# Altium schematic sheet Relay connected.SchDoc
size A2
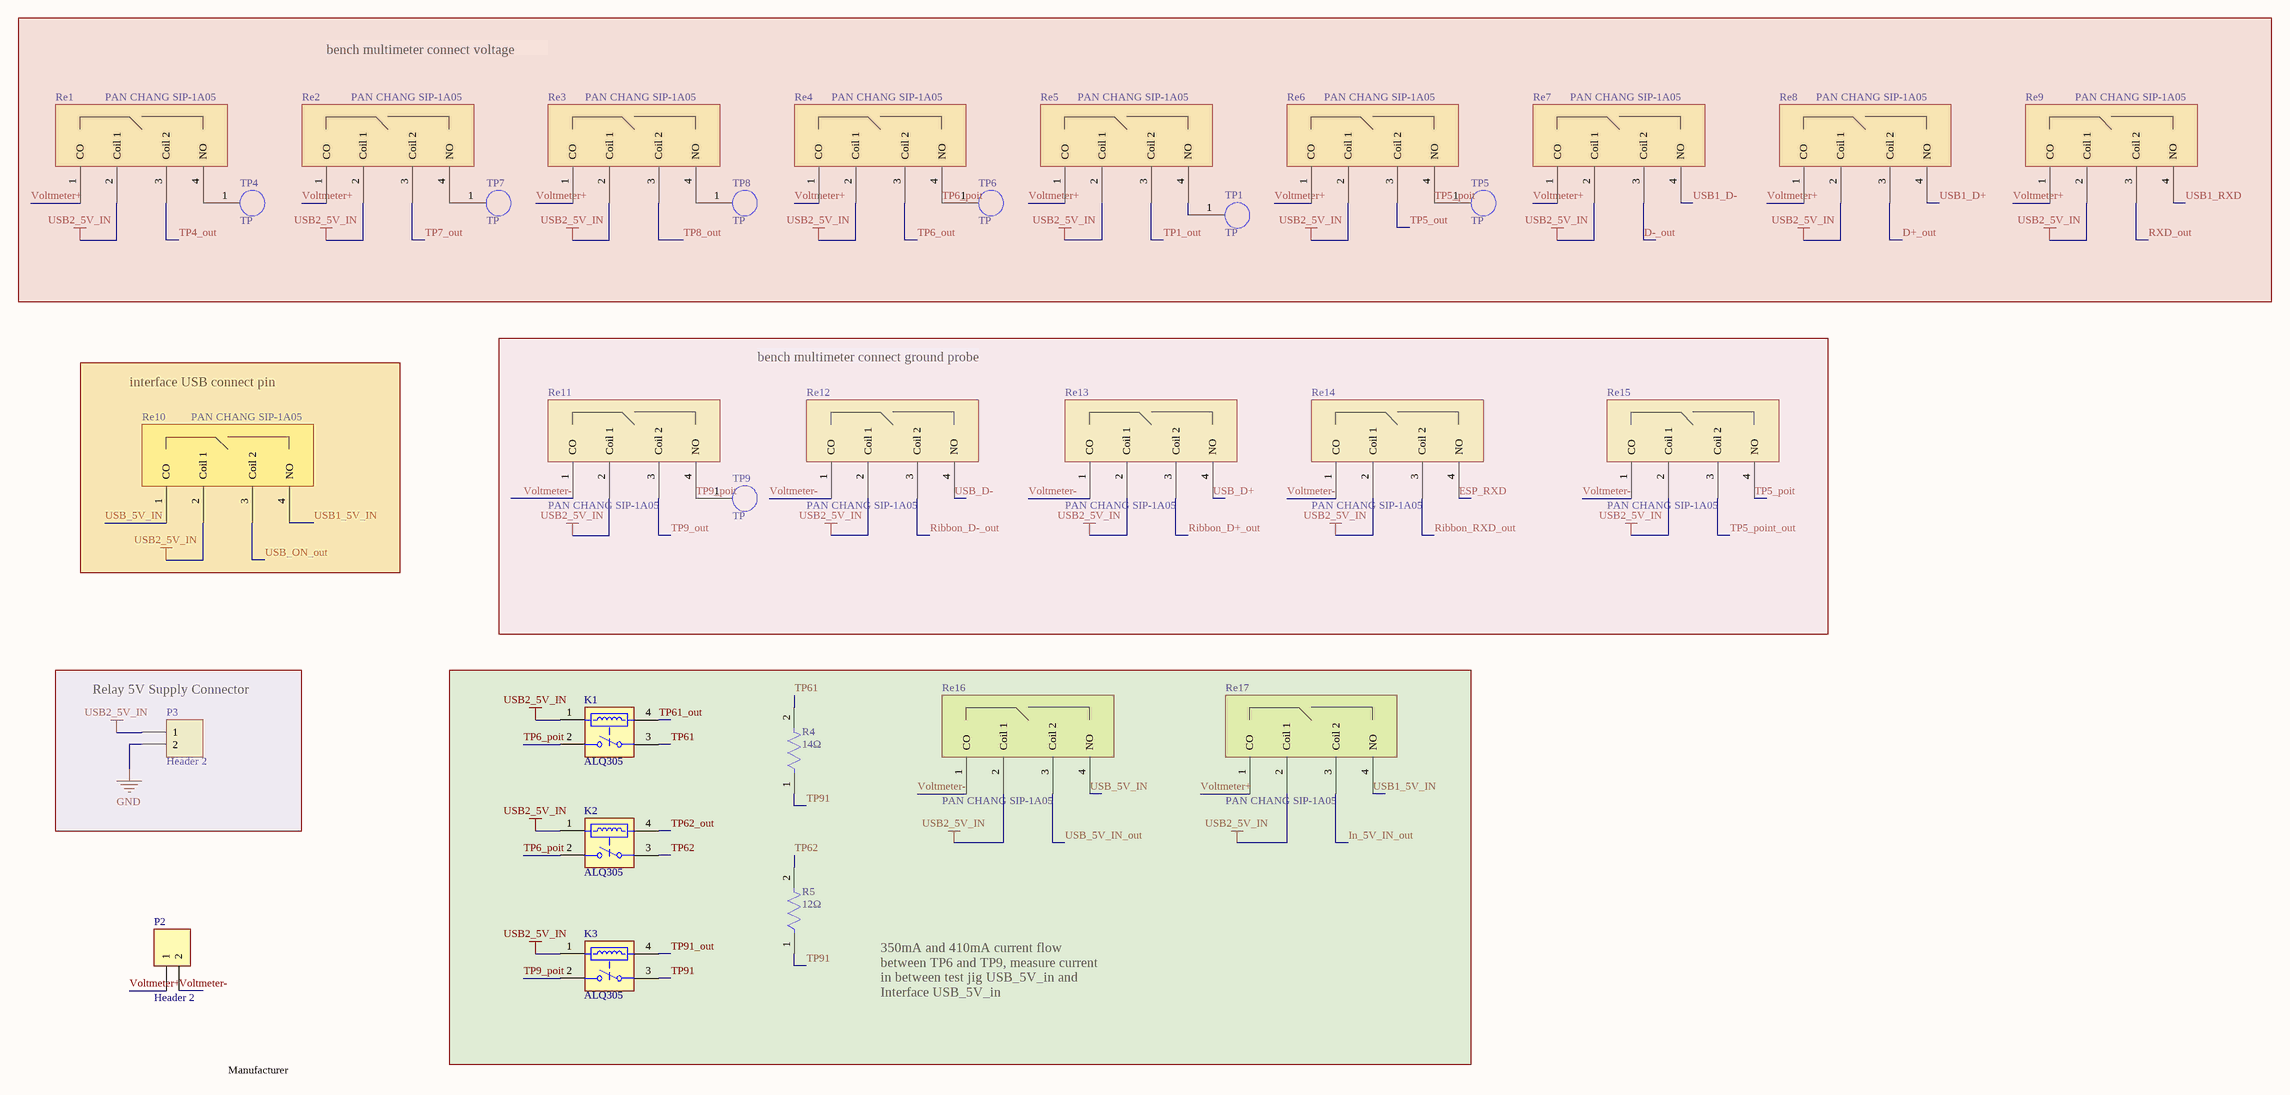
[diagram p0: Relay connected.SchDoc]

## Parts
K1  ALQ305  [PNSC-LQ-4-2000x1000x1600_V]
K2  ALQ305  [PNSC-LQ-4-2000x1000x1600_V]
K3  ALQ305  [PNSC-LQ-4-2000x1000x1600_V]
P2  Header 2  [HDR1X2]
P3  Header 2  [HDR1X2]
R4  14Ω  [FP-CRCW0603-e3-IPC_B]
R5  12Ω  [FP-CRCW0805-e3-IPC_C]
Re1  PAN CHANG SIP-1A05  [PAN CHANG SIP-1A05]
Re2  PAN CHANG SIP-1A05  [PAN CHANG SIP-1A05]
Re3  PAN CHANG SIP-1A05  [PAN CHANG SIP-1A05]
Re4  PAN CHANG SIP-1A05  [PAN CHANG SIP-1A05]
Re5  PAN CHANG SIP-1A05  [PAN CHANG SIP-1A05]
Re6  PAN CHANG SIP-1A05  [PAN CHANG SIP-1A05]
Re7  PAN CHANG SIP-1A05  [PAN CHANG SIP-1A05]
Re8  PAN CHANG SIP-1A05  [PAN CHANG SIP-1A05]
Re9  PAN CHANG SIP-1A05  [PAN CHANG SIP-1A05]
Re10  PAN CHANG SIP-1A05  [PAN CHANG SIP-1A05]
Re11  PAN CHANG SIP-1A05  [PAN CHANG SIP-1A05]
Re12  PAN CHANG SIP-1A05  [PAN CHANG SIP-1A05]
Re13  PAN CHANG SIP-1A05  [PAN CHANG SIP-1A05]
Re14  PAN CHANG SIP-1A05  [PAN CHANG SIP-1A05]
Re15  PAN CHANG SIP-1A05  [PAN CHANG SIP-1A05]
Re16  PAN CHANG SIP-1A05  [PAN CHANG SIP-1A05]
Re17  PAN CHANG SIP-1A05  [PAN CHANG SIP-1A05]
TP1  TP  [Testpoint]  (net tie, no BOM)
TP4  TP  [Testpoint]  (net tie, no BOM)
TP5  TP  [Testpoint]  (net tie, no BOM)
TP6  TP  [Testpoint]  (net tie, no BOM)
TP7  TP  [Testpoint]  (net tie, no BOM)
TP8  TP  [Testpoint]  (net tie, no BOM)
TP9  TP  [Testpoint]  (net tie, no BOM)

## Nets
GND: P3.2
USB2_5V_IN: K1.1 K2.1 K3.1 P3.1 Re1.2(Coil_1) Re2.2(Coil_1) Re3.2(Coil_1) Re4.2(Coil_1) Re5.2(Coil_1) Re6.2(Coil_1) Re7.2(Coil_1) Re8.2(Coil_1) Re9.2(Coil_1) Re10.2(Coil_1) Re11.2(Coil_1) Re12.2(Coil_1) Re13.2(Coil_1) Re14.2(Coil_1) Re15.2(Coil_1) Re16.2(Coil_1) Re17.2(Coil_1)
D+_out: Re8.3(Coil_2)
D-_out: Re7.3(Coil_2)
ESP_RXD: Re14.4(NO)
In_5V_IN_out: Re17.3(Coil_2)
Ribbon_D+_out: Re13.3(Coil_2)
Ribbon_D-_out: Re12.3(Coil_2)
Ribbon_RXD_out: Re14.3(Coil_2)
RXD_out: Re9.3(Coil_2)
TP1_out: Re5.3(Coil_2)
TP4_out: Re1.3(Coil_2)
TP5_out: Re6.3(Coil_2)
TP5_point_out: Re15.3(Coil_2)
TP5_poit: Re6.4(NO) Re15.4(NO) TP5.1
TP6_out: Re4.3(Coil_2)
TP6_poit: K1.2(NO) K2.2(NO) Re4.4(NO) TP6.1
TP7_out: Re2.3(Coil_2)
TP8_out: Re3.3(Coil_2)
TP9_out: Re11.3(Coil_2)
TP9_poit: K3.2(NO) Re11.4(NO) TP9.1
TP61: K1.3(COM) R4.2
TP61_out: K1.4
TP62: K2.3(COM) R5.2
TP62_out: K2.4
TP91: K3.3(COM) R4.1 R5.1
TP91_out: K3.4
USB1_5V_IN: Re10.4(NO) Re17.4(NO)
USB1_D+: Re8.4(NO)
USB1_D-: Re7.4(NO)
USB1_RXD: Re9.4(NO)
USB_5V_IN: Re10.1(CO) Re16.4(NO)
USB_5V_IN_out: Re16.3(Coil_2)
USB_D+: Re13.4(NO)
USB_D-: Re12.4(NO)
USB_ON_out: Re10.3(Coil_2)
Voltmeter+: P2.1 Re1.1(CO) Re2.1(CO) Re3.1(CO) Re4.1(CO) Re5.1(CO) Re6.1(CO) Re7.1(CO) Re8.1(CO) Re9.1(CO) Re17.1(CO)
Voltmeter-: P2.2 Re11.1(CO) Re12.1(CO) Re13.1(CO) Re14.1(CO) Re15.1(CO) Re16.1(CO)
NetRe1_4: Re1.4(NO) TP4.1
NetRe2_4: Re2.4(NO) TP7.1
NetRe3_4: Re3.4(NO) TP8.1
NetRe5_4: Re5.4(NO) TP1.1

## Notes on the sheet
- bench multimeter connect voltage probe
- interface USB connect pin
- bench multimeter connect ground probe
- (near P3) Relay 5V Supply Connector
- 350mA and 410mA current flow between TP6 and TP9, measure current in between test jig USB_5V_in and Interface USB_5V_in
- Manufacturer
- Title
- Size:
- Date:
- File:
- A2
- Number:
- Time:
- Revision:
- Sheet
- of

## Library data of the parts
K1-K3 = CMP-1503-00188-1: LQ Relays, 5 V Coil Voltage, 200 mW Nominal Operating Power, -40 to 85 degC, 4-Pin LQ, Carton, Case, RoHS; Manufacturer: Panasonic; Pb-Free: True; Nominal Operating Power: 200 mW; Max Switching Voltage: 250 V AC; Coil Voltage: 5 V; Max Switching Current: 10 A (N.O.), 3 A (N.C.); Mechanical Life(Min.operation): 1x10^7; Electrical Life: 5x10^4; ComponentLink2URL: http://www3.panasonic.biz/ac/e_download/control/relay/power/catalog/mech_eng_lq.pdf?f_cd=401220; ComponentLink3Description: Package Specification; Mfr. Part #: ALQ305; PackageDescription: 4-Pin Through Hole Terminal Package, Body 20 x 10 mm; Packing: Carton, Case; ComponentLink2Description: Datasheet; ComponentLink1URL: http://www3.panasonic.biz/ac/ae/index.jsp; PackageReference: LQ-4-2000x1000x1600; DatasheetVersion: 201410-T; Mounting Technology: Through Hole; RoHS: True; ComponentLink3URL: http://www3.panasonic.biz/ac/e_download/control/relay/power/catalog/mech_eng_lq.pdf?f_cd=401220; ComponentLink1Description: Manufacturer URL; PackageVersion: ASCTB92E, 10/2014; Series: LQ Relays
P2 P3 = Header 2: Header, 2-Pin; LatestRevisionDate: 17-Jul-2002; LatestRevisionNote: Re-released for DXP Platform.; Publisher: Altium Limited
R4 = CMP-02407-002335-1: RES Thick Film, 14Ω, 1%, 0.1W, 100ppm/°C, 0603; Manufacturer: SEI(Stackpole Elec); Mfr. Part #: RC0603FR-0714RL; Max Power Dissipation: 100mW; Voltage Rating (DC): 75V; Resistance: 14R; Contact Plating: Tin; Radiation Hardening: No; Features: Automotive AEC-Q200; Case Code (Imperial): 0603; Case Code (Metric): 1608; Case/Package: 0603; Lead Free: Lead Free; Max Operating Temperature: 155°C; Package Quantity: 10; Depth: 0.85mm; Weight: 7.1E-05oz; Temperature Coefficient: 100ppm/°C; Width: 0.033inch; Military Standard: Not; Composition: Thick Film; Min Operating Temperature: -55°C; Number of Pins: 2; Voltage Rating: 75V; Length: 1.55mm; Power Rating: 100mW; Number of Terminations: 2; Packaging: Tape and Reel; Height: 0.02inch; Tolerance: 1%
R5 = CMP-1013-00292-2: RES Thick Film, 12Ω, 1%, 0.125W, 100ppm/°C, 0805; Manufacturer: Vishay; Mfr. Part #: CRCW080512R0FKEA; Resistance: 12R; Voltage Rating: 150V; Max Power Dissipation: 125mW; Max Operating Temperature: 155°C; Composition: Thick Film; Case/Package: 0805; Length: 2mm; Features: Automotive AEC-Q200; Termination: SMD/SMT; Width: 0.049inch; Weight: 0.000194oz; Military Standard: Not; Lead Free: Lead Free; Temperature Coefficient: 100ppm/°C; Power Rating: 125mW; Case Code (Imperial): 0805; Number of Terminations: 2; Voltage Rating (DC): 150V; Height: 0.02inch; Depth: 1.25mm; Case Code (Metric): 2012; Packaging: Tape and Reel; Tolerance: 1%; Package Quantity: 10; Min Operating Temperature: -55°C
Re1-Re17 = PAN CHANG SIP-1A05: SPST - NO 5V DC Nolocking Through Hole Reed Relays ROHS; Mfr. Part #: SIP-1A05; LCSC Part #: C10496
  Re16: Manufacturer: PAN CHANG